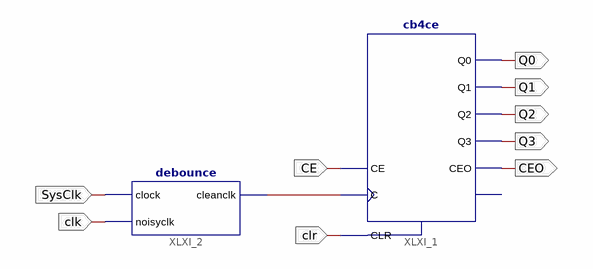
[diagram p0: schematic sheet 1]
// Xilinx ISE schematic task2.sch (spartan6) as structural Verilog: 2 symbols, 9 ports
module task2 (
  input  clr,
  input  CE,
  input  SysClk,
  input  clk,
  output Q0,
  output Q1,
  output Q2,
  output Q3,
  output CEO
);

  wire XLXN_1;

  cb4ce XLXI_1 (.C(XLXN_1), .CE(CE), .CLR(clr), .CEO(CEO), .Q0(Q0), .Q1(Q1), .Q2(Q2), .Q3(Q3));  // open: TC
  debounce XLXI_2 (.clock(SysClk), .noisyclk(clk), .cleanclk(XLXN_1));
endmodule
